# EasyEDA schematic SCH_SpotifyControllerPCB_2024-07-13.json
TITLE: Sheet_1; REV: 1.0; Date: 2024-07-13; Sheet: 1/1; Drawn By: mysticnitroacc1; Company: Your Company
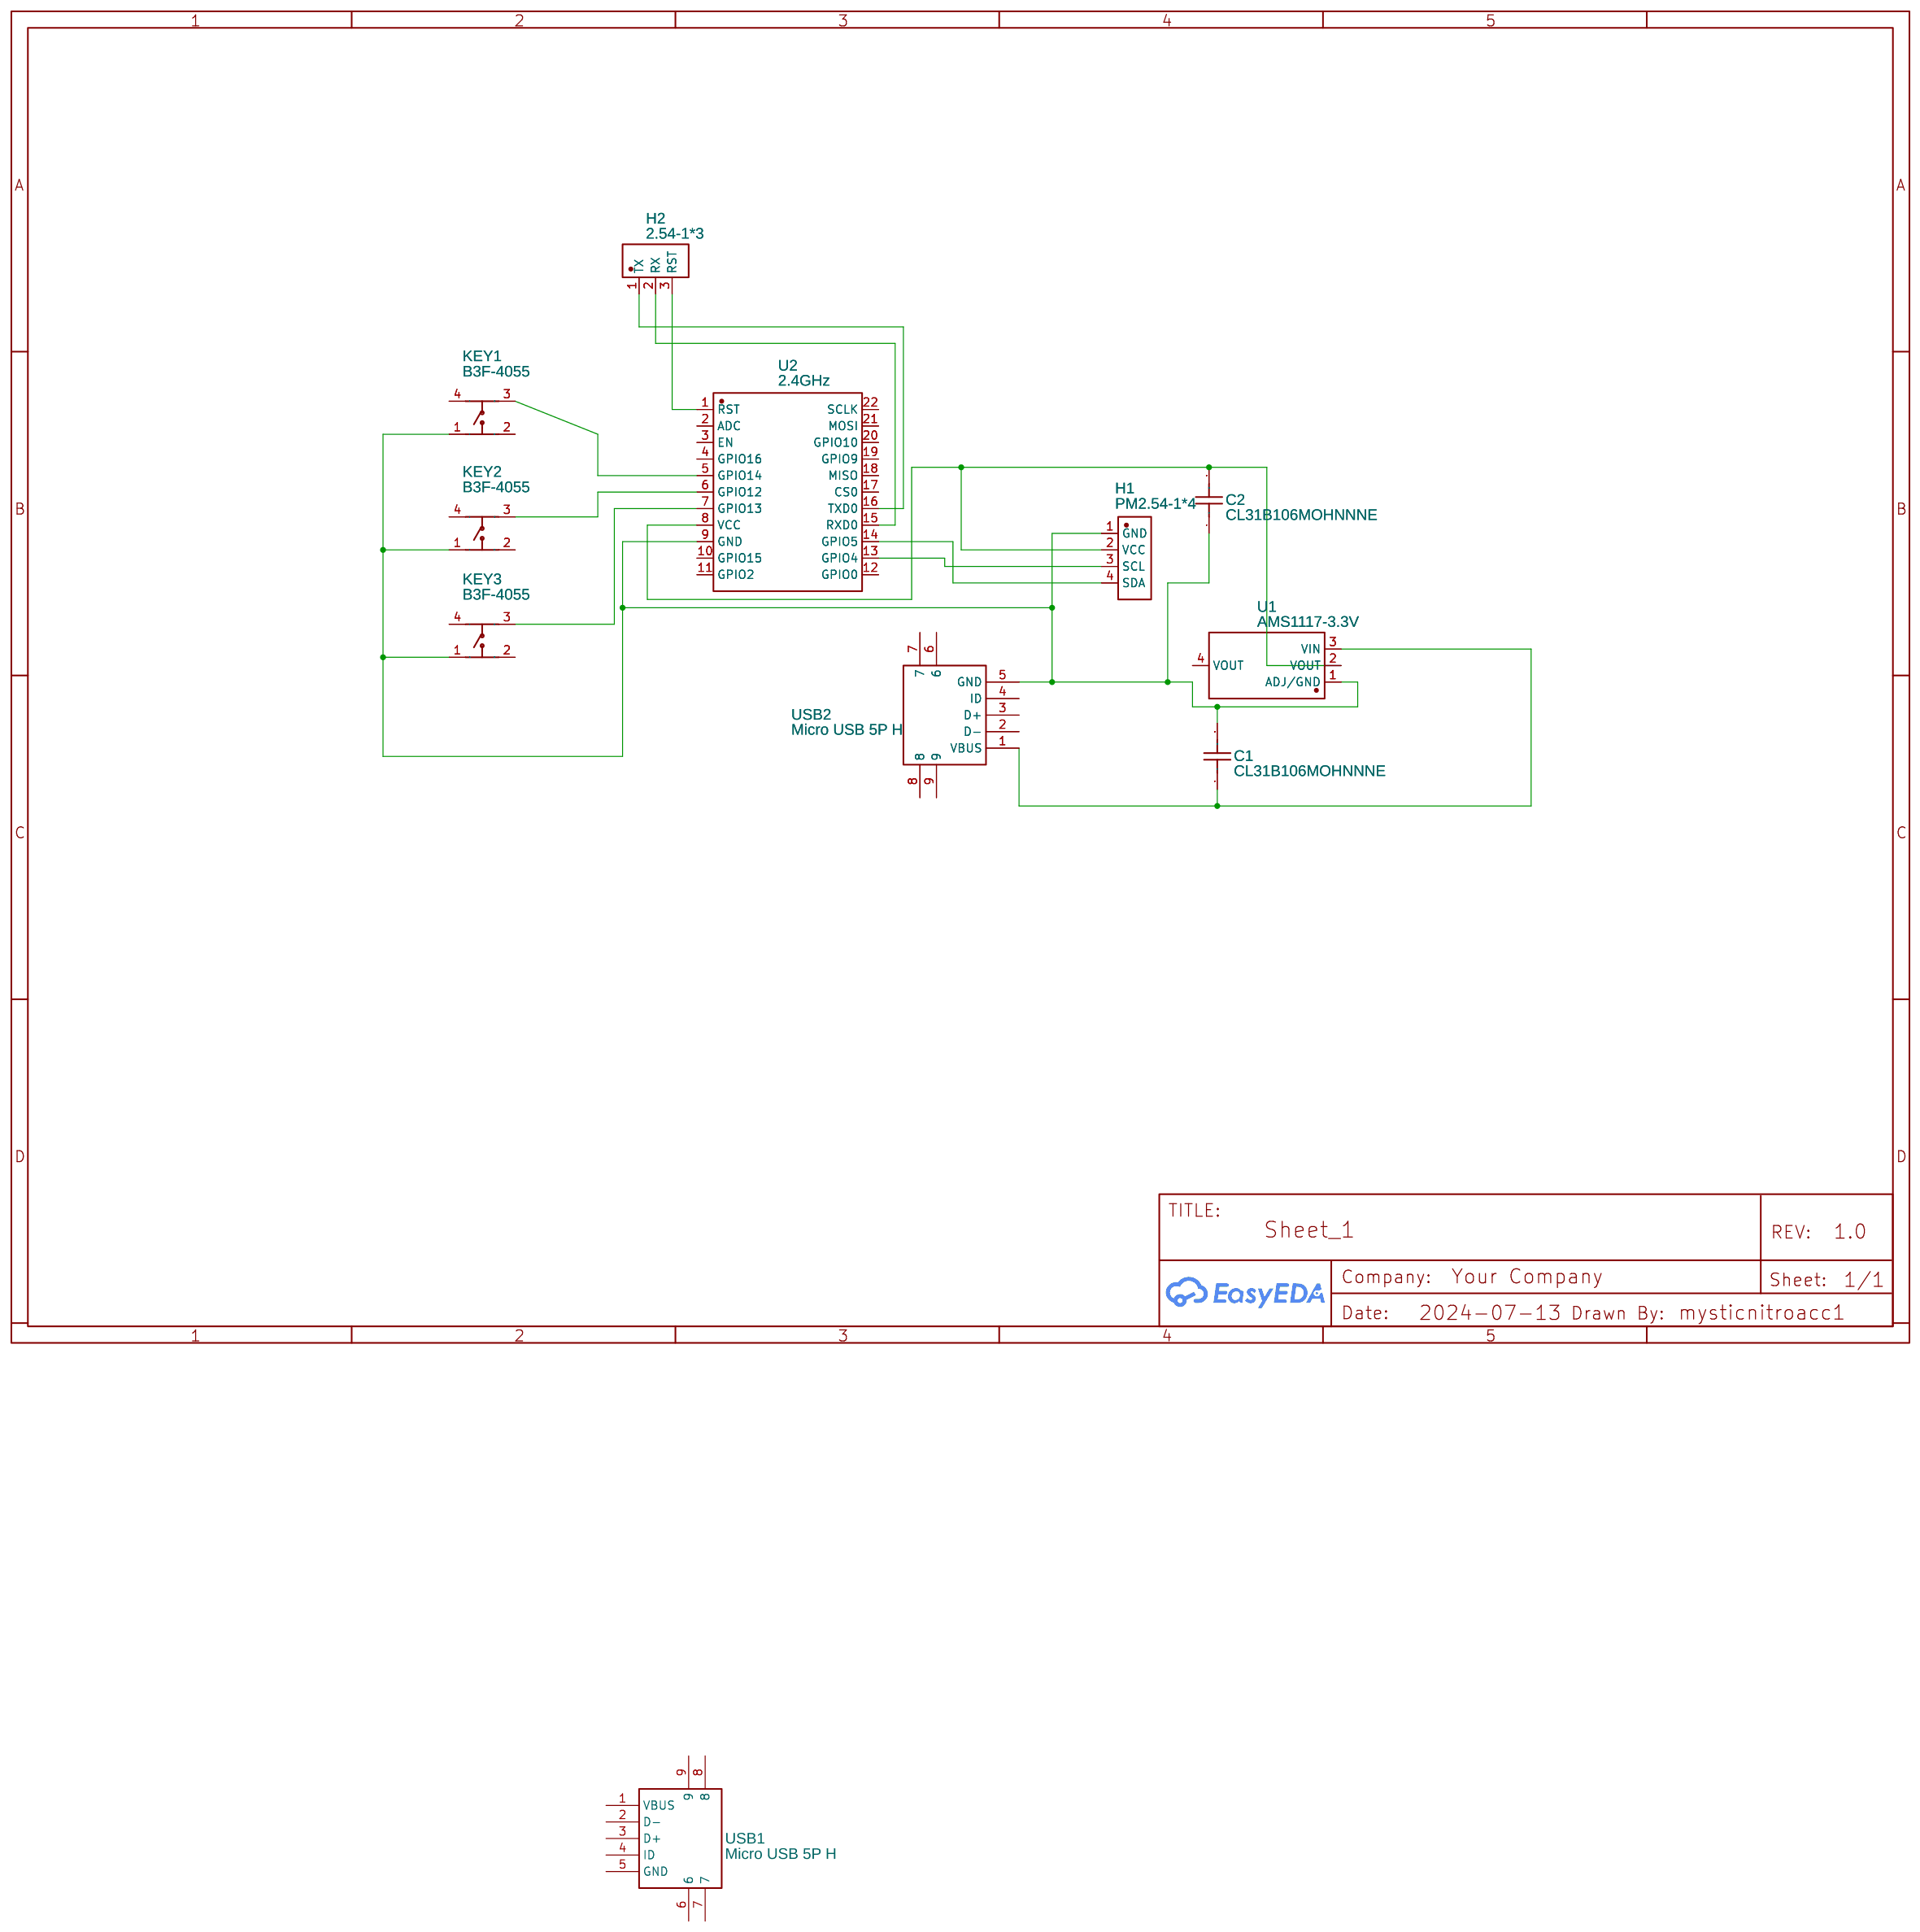
[diagram p0: schematic sheet]

## Parts
C1  CL31B106MOHNNNE  [C 1206]
C2  CL31B106MOHNNNE  [C 1206]
H1  PM2.54-1*4  [HDR-TH_4P-P2.54-V-F]
H2  2.54-1*3  [HDR-TH_3P-P2.54-V-M-1]
KEY1  B3F-4055  [KEY-TH_4P-L12.0-W12.0-P5.00-LS13.4-EH]
KEY2  B3F-4055  [KEY-TH_4P-L12.0-W12.0-P5.00-LS13.4-EH]
KEY3  B3F-4055  [KEY-TH_4P-L12.0-W12.0-P5.00-LS13.4-EH]
U1  AMS1117-3.3V  [SOT-223-4_L6.5-W3.5-P2.30-LS7.0-BR]
U2  2.4GHz  [WIFIM-SMD_ESP-12F-ESP8266MOD]
USB1  Micro USB 5P H  [MICRO-USB_MICRO-USB-30]
USB2  Micro USB 5P H  [MICRO-USB_MICRO-USB-30]

## Library data of the parts
C1 C2 = CL31B106MOHNNNE: Manufacturer: Samsung Electro-Mechanics; Supplier: Digi-Key; Supplier Part: 1276-6641-1-ND; link: https://www.digikey.ca/fr/products/detail/samsung-electro-mechanics/CL31B106MOHNNNE/5961125; Contributor: optechalexd
H1 = PM2.54-1*4: Contributor: lcsc; Supplier: LCSC; Supplier Part: C5116530; Manufacturer: ZHOURI(洲日); JLCPCB Part Class: Extended Part
H2 = 2.54-1*3: Contributor: lcsc; Supplier: LCSC; Supplier Part: C5116482; Manufacturer: ZHOURI(洲日); JLCPCB Part Class: Extended Part
KEY1-KEY3 = B3F-4055: Supplier: LCSC; Manufacturer: OMRON(欧姆龙); Supplier Part: C84931; JLCPCB Part Class: Extended Part
U1 = AMS1117-3.3V: Contributor: LCSC; Supplier: LCSC; Supplier Part: C2688239; Manufacturer: WPMtek(维攀); JLCPCB Part Class: Extended Part
U2 = ESP-12F(ESP8266MOD): Supplier: LCSC; Manufacturer: Ai-Thinker(安信可); Supplier Part: C82891; JLCPCB Part Class: Extended Part
USB1 USB2 = Micro USB 5P H: Contributor: LCSC; Supplier: LCSC; Supplier Part: C40946; Manufacturer: 精拓金; Manufacturer Part: 920-E52A2021S10101; JLCPCB Part Class: Extended Part

## Nets
Net-(C1-1): C1.1 U1.3(VIN) USB2.1(VBUS)
Net-(C1-2): C1.2 C2.1 H1.1(GND) KEY1.1 KEY2.1 KEY3.1 U1.1(ADJ/GND) U2.9(GND) USB2.5(GND)
Net-(C2-2): C2.2 H1.2(VCC) U1.2(VOUT) U2.8(VCC)
Net-(H1-3): H1.3(SCL) U2.13(GPIO4)
Net-(H1-4): H1.4(SDA) U2.14(GPIO5)
Net-(H2-1): H2.1(TX) U2.16(TXD0)
Net-(H2-2): H2.2(RX) U2.15(RXD0)
Net-(H2-3): H2.3(RST) U2.1(RST)
Net-(KEY1-3): KEY1.3 U2.5(GPIO14)
Net-(KEY2-3): KEY2.3 U2.6(GPIO12)
Net-(KEY3-3): KEY3.3 U2.7(GPIO13)

Not connected (* = marked no-connect by the designer): KEY1 2 4; KEY2 2 4; KEY3 2 4; U1 4(VOUT); U2 2(ADC) 3(EN) 4(GPIO16) 10(GPIO15) 11(GPIO2) 12(GPIO0) 17(CS0) 18(MISO) 19(GPIO9) 20(GPIO10) 21(MOSI) 22(SCLK); USB1 1(VBUS) 2(D-) 3(D+) 4(ID) 5(GND) 6 7 8 9; USB2 2(D-) 3(D+) 4(ID) 6 7 8 9
